# Altium project Encoder_v2.1.PrjPcb
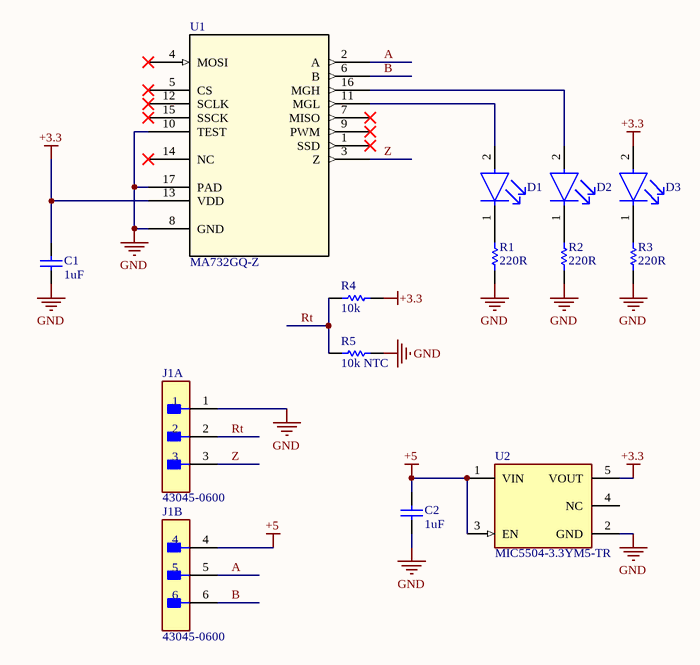
[diagram p0: MAIN.SchDoc]
1 sheet, 13 parts. Net scope: global (net labels, ports and power ports of the same name join across sheets).
Board file: Encoder_v2.1.PcbDoc

## Sheet MAIN.SchDoc
size A4; SheetNumber: 1; SheetTotal: 1

### Parts
C1  1uF  [CAPC2013X145X50LL20T25]
C2  1uF  [CAPC2013X145X50LL20T25]
D1  150080SS75000  [FP-150080SS75000-MFG]  (value not drawn)
D2  150080SS75000  [FP-150080SS75000-MFG]  (value not drawn)
D3  150080SS75000  [FP-150080SS75000-MFG]  (value not drawn)
J1  43045-0600  [FP-0430450600-MFG]  (parts A,B of 2)
R1  220R  [RESC2013X70X40NL20T20]
R2  220R  [RESC2013X70X40NL20T20]
R3  220R  [RESC2013X70X40NL20T20]
R4  10k  [RESC1609X55X30NL15T15]
R5  10k NTC  [RESC1608X90X30NL15T20]
U1  MA732GQ-Z  [QFN-16_MA732]
U2  MIC5504-3.3YM5-TR  [FP-SOT23-5LD-PL-1-MFG]

### Nets
+3.3: C1.2 D3.2(A) R4.2 U1.13(VDD) U2.5(VOUT)
+5: C2.2 J1.4 U2.1(VIN) U2.3(EN)
GND: C1.1 C2.1 J1.1 R1.1 R2.1 R3.1 R5.2 U1.8(GND) U1.10(TEST) U1.17(PAD) U2.2(GND)
A: J1.5 U1.2(A)
B: J1.6 U1.6(B)
Rt: J1.2 R4.1 R5.1
Z: J1.3 U1.3(Z)
NetD1_1: D1.1(C) R1.2
NetD1_2: D1.2(A) U1.11(MGL)
NetD2_1: D2.1(C) R2.2
NetD2_2: D2.2(A) U1.16(MGH)
NetD3_1: D3.1(C) R3.2

Not connected (* = marked no-connect by the designer): U1 1(SSD)* 4(MOSI)* 5(CS)* 7(MISO)* 9(PWM)* 12(SCLK)* 14(NC)* 15(SSCK)*; U2 4(NC)

### Library data of the parts
C1 C2 = CMP-1036-04746-2: Manufacturer: Kemet; Part Number: C0805C105K4PACTU
D1-D3 = CMP-1426-00010-2: LED RED CLEAR 0805 SMD; Forward Voltage: 1.9V; Luminous Intensity: 60mcd; Dominant Wavelength: 630nm; Forward Current: 30mA; Viewing Angle: 140°; Lens Color: Colorless; Test Current: 20mA; Lens Size: 1.25mm; Packaging: Cut Tape; Width: 1.25mm; Case Code (Metric): 2012; Max Operating Temperature: 85°C; RoHS Compliant: Yes; Mount: Surface Mount; Case/Package: 0805; Series: WL-SMCW; Length: 2mm; Case Code (Imperial): 0805; Wavelength: 630nm; Lens Style: Clear; Min Operating Temperature: -40°C; Color: Red; Lens Transparency: Clear; Package Quantity: 1; Height: 0.8mm
J1 = CMP-00257-00287064-1: 43045-0600 Connector Wire to Board Header 6 Position 3mm Solder Right Angle Thru-Hole Tray; NexarPartId: 287064; Manufacturer Lifecycle Status: ACTIVE; Max Current Rating: 5A; Voltage Rating (AC): 250V; Number of Positions: 6; Insulation Resistance: 1GΩ; Glow Wire Compliant: Compliant; Approvals: CSA, TUV, UL; Max Voltage Rating (DC): 250.25kV; Contact Resistance: 10mΩ; Plating: Tin; Gender: Male; Radiation Hardening: No; Number of Rows: 2; Lifecycle Status: Production; Row Spacing: 3mm; Orientation: Right Angle, Vertical; Housing Material: Thermoplastic; Diameter: 3mm; Termination: Solder; Height: 7.37mm; Min Operating Temperature: -40°C; Max Operating Temperature: 105°C; Depth: 12.2mm; Pitch: 3mm; Length: 12.6mm; Current Rating: 5A; Lead Free: Lead Free; Voltage Rating: 250V; Housing Color: Black; Mount: Through Hole; Number of Circuits: 6; Contact Plating: Tin; Country of Origin: US; Flammability Rating: UL94 V-0; RoHS: Compliant; Contact Material: Brass, Tin; Color: Black; Width: 9.9mm; Voltage Rating (DC): 250V; Lead Pitch: 3mm; Case/Package: SMC; REACH SVHC: No SVHC; Schedule B: 8536694040; Packaging: Bulk; Number of Pins: 6; Halogen Free: Low Halogen; Number of Contacts: 6; Material: Polyester
R1-R3 = CMP-2001-00550-5: Chip Resistor, 4.7 KOhm, +/- 1%, 0.125 W, -55 to 155 degC, 0805 (2012 Metric), RoHS, Tape and Reel; Manufacturer: Panasonic; Voltage Rating: 150 V; Min Operating Temperature: -55 degC; PackageReference: 0805; Mounting Technology: Surface Mount; Height: 0.6 mm; PackageDescription: 2-Pin Surface Mount Device, Body 2 x 1.25 mm; RoHSCompliant: true; Length: 2 mm; REACH SVHC: Yes; Packaging: Tape and Reel; Pins: 2; Mount: Surface Mount; ComponentLink2Description: Datasheet; ComponentLink1URL: http://www.panasonic.com/; ComponentLink1Description: Manufacturer URL; DatasheetVersion: 04/2015; Package Quantity: 5000; ComponentLink2URL: http://industrial.panasonic.com/cdbs/www-data/pdf/RDA0000/AOA0000C86.pdf; Max Operating Temperature: 155 degC
R4 = CMP-1012-00623-3: Chip Resistor, 10 KOhm, +/- 1%, 0.1 W, -55 to 155 degC, 0603 (1608 Metric), RoHS, Tape and Reel; Manufacturer: Panasonic; Voltage Rating: 75V; Case\/Package: 0603; Power Rating: 100mW; Resistance: 10KOhm; Temperature Coefficient: 100ppm\/degreesC; Number of Pins: 2; Package Reference: 603; Depth: 0.8mm; Mount: SurfaceMount; Package Description: 2-Pin Surface Mount Device, Body 1.6 x 0.85 mm; Datasheet Version: 02/2017; Length: 1.6mm; Lead Free: LeadFree; Height: 0.45mm; Number of Terminations: 2; Max Power Dissipation: 100mW; Min Operating Temperature: -55degC; Datasheet URL: https://industrial.panasonic.com/cdbs/www-data/pdf/RDA0000/AOA0000C304.pdf; Termination: SMD/SMT; Case Code (Metric): 1608; Case Code (Imperial): 0603; Tolerance: 1%; Max Operating Temperature: 155degC; RoHSCompliant: true; Voltage Rating (DC): 75V; Radiation Hardening: No; Packaging: TapeandReel; Composition: ThickFilm; Mounting Technology: SurfaceMount; Manufacturer URL: http://www.panasonic.com/; Width: 0.031inch; REACH SVHC: NoSVHC; Contact Plating: Tin; Military Standard: Not; Package Quantity: 1
R5 = CMP-2000-00869-1: Part Number: ERT-J1VR103J; Manufacturer: Panasonic
U1 = MA732GQ-Z: No Description Available; Mfr_Name: Monolithic Power Systems; Copyright: Copyright (C) 2023 Ultra Librarian. All rights reserved.; Manufacturer_Part_Number: MA732GQ-Z; RefDes: RefDes; Type: DEV
U2 = CMP-2000-07604-2: IC REG LINEAR 3.3V 300MA SOT23-5; Quiescent Current: 38uA; Operating Supply Current: 42uA; Max Input Voltage: 5.5V; Min Input Voltage: 2.5V; Output Type: Fixed; Power Supply Rejection Ratio (PSRR): 60dB; Dropout Voltage: 380mV; Accuracy: 3%; Number of Outputs: 1; Nominal Output Voltage: 3.3V; Max Output Current: 300mA; Length: 2.9mm; Mount: Surface Mount; Width: 1.6mm; Packaging: Tape and Reel; Output Current: 300mA; Min Operating Temperature: -40°C; Max Operating Temperature: 125°C; Height: 1.1mm; Case/Package: SOT-23-5; REACH SVHC: No SVHC; Number of Pins: 5; Output Voltage: 3.3V